# EAGLE schematic led-cpu-rev2 (EAGLE 6.4)
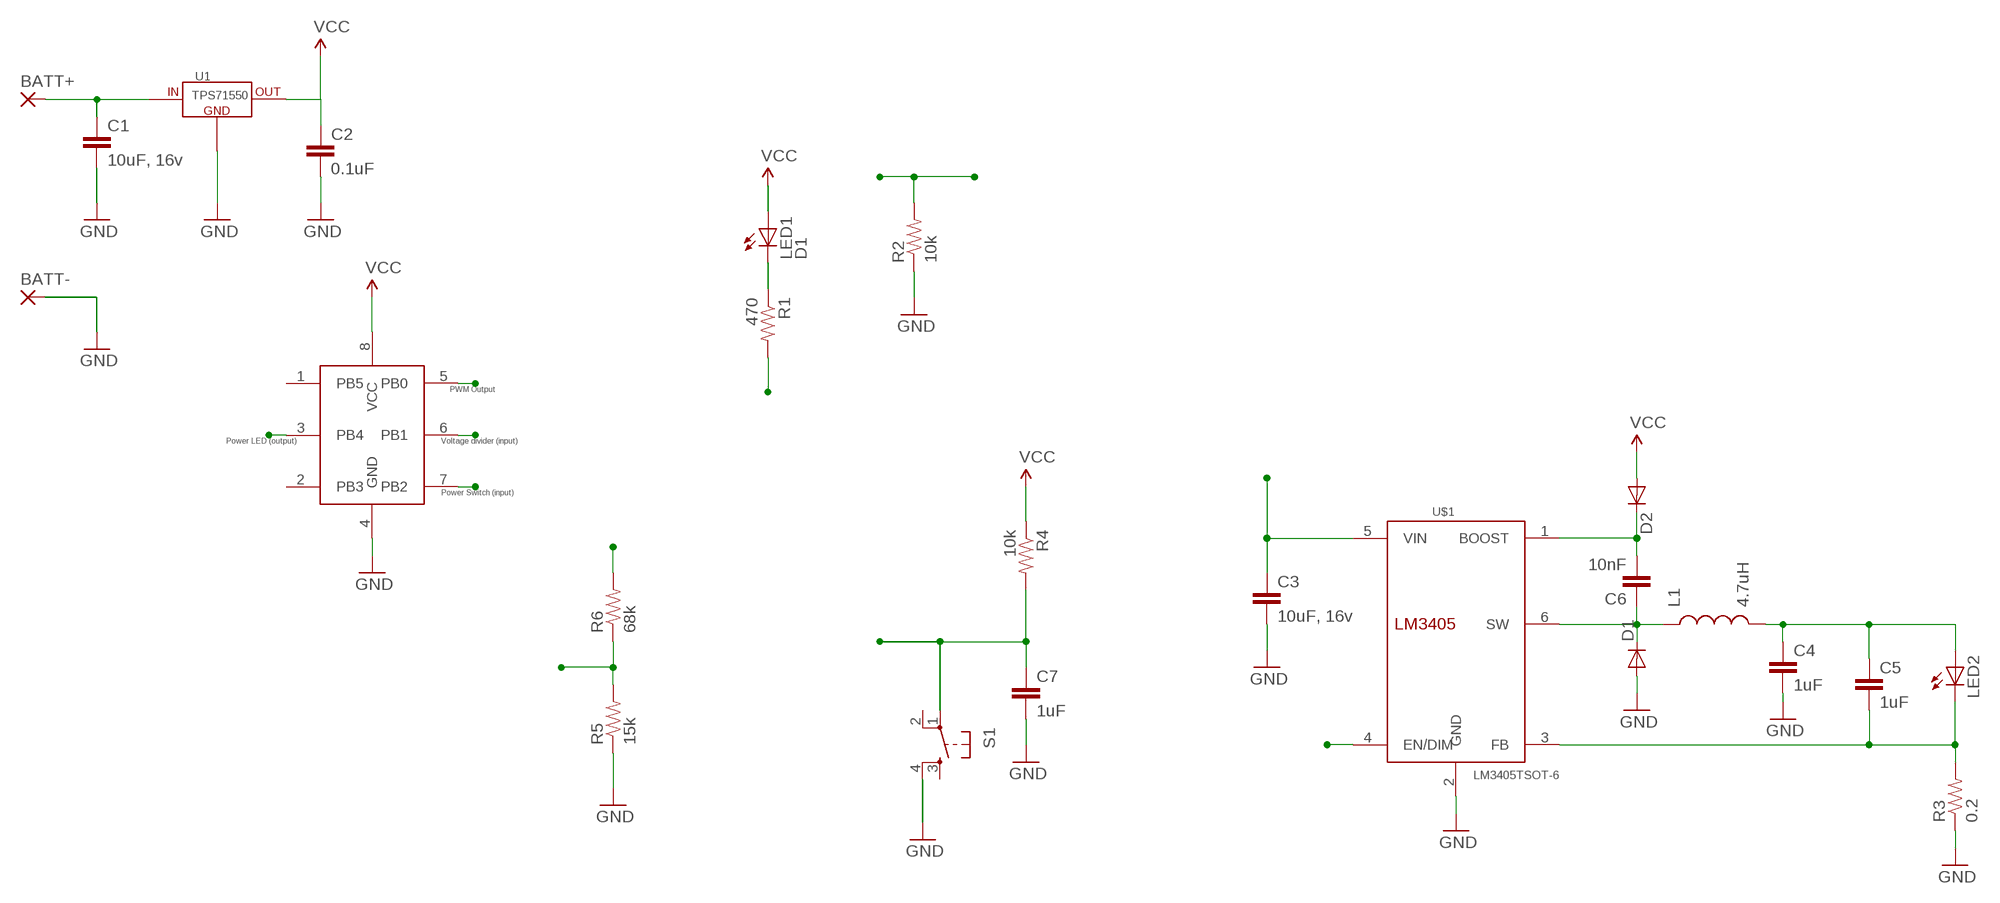
[diagram p0: schematic, sheet 1]

## Parts
BATT+  SMD5  [SMD2,54-5,08]
BATT-  SMD5  [SMD2,54-5,08]
C1  10uF, 16v  CAP0805  [0805]
C2  0.1uF  CAP0805  [0805]
C3  10uF, 16v  CAP0805  [0805]
C4  1uF  CAP1206  [1206]
C5  1uF  CAP1206  [1206]
C6  10nF  CAP0805  [0805]
C7  1uF  CAP0805  [0805]
D1  DIODESMA  [SMA-DIODE]
D2  DIODESOD  [SOD-323]
L1  4.7uH  INDUCTOR1210  [1210]
LED1  D1  LEDCHIPLED_0603  [CHIPLED_0603]
LED2  LED3MM  [LED3MM]
R1  470  RESISTOR0805-RES  [0805]
R2  10k  RESISTOR0805-RES  [0805]
R3  0.2  RESISTOR1206  [1206]
R4  10k  RESISTOR0805-RES  [0805]
R5  15k  RESISTOR0805-RES  [0805]
R6  68k  RESISTOR0805-RES  [0805]
S1  TAC_SWITCHPTH  [TACTILE-PTH]
U1  TPS71550  TPS715XX  [SOT-23-5]
U2  ATTINY13  [WSOIC-8]
U$1  LM3405TSOT-6  [TSOT-6]

## Nets
BATT+: BATT+.1(P) C1.1 C3.1 R6.2 U1.4(IN) U$1.5(VIN)
GND: BATT-.1(P) C1.2 C2.2 C3.2 C4.2 C7.2 D1.A R2.1 R3.1 R5.1 S1.4 U1.2(GND) U2.4(GND) U$1.2(GND)
IND_LED_B: R1.2 U2.3(PB4)
N$1: LED1.C R1.1
N$2: C5.2 LED2.K(C) R3.2 U$1.3(FB)
N$3: C6.1 D1.C L1.1 U$1.6(SW)
N$4: C6.2 D2.1(C) U$1.1(BOOST)
N$5: C4.1 C5.1 L1.2 LED2.A
PWM_OUT: R2.2 U2.5(PB0) U$1.4(EN/DIM)
PWR_SW: C7.1 R4.2 S1.1 U2.7(PB2)
VCC: C2.1 D2.2(A) LED1.A R4.1 U1.5(OUT) U2.8(VCC)
VDIV: R5.2 R6.1 U2.6(PB1)
Unconnected: S1.2 S1.3 U2.1(PB5) U2.2(PB3)

## Notes on the sheet
- PWM Output
- Power LED (output) | Voltage divider (input)
- Power Switch (input)

## Library data of the parts
BATT+ BATT- = wirepad:SMD5: SMD PAD
C1-C7 = SparkFun-Capacitors:CAP: Capacitor Standard 0603 ceramic capacitor, and 0.1" leaded capacitor.
D1 D2 = SparkFun-DiscreteSemi:DIODE: Diode These are standard reverse protection diodes and small signal diodes. SMA package can handle up to about 1A. SOD-323 can handle about 200mA. What the SOD-323 package when ordering, there are some mfgs out there that are 5-pin packages.
L1 = SparkFun-Passives:INDUCTOR: Inductors Basic Inductor/Choke - 0603 and 1206. Footprints are not proven and vary greatly between part numbers.
LED1 = led:LED: LED OSRAM: - CHIPLED LG R971, LG N971, LY N971, LG Q971, LY Q971, LO R971, LY R971 LH N974, LH R974 LS Q976, LO Q976, LY Q976 LO Q996 - Hyper CHIPLED LW Q18S LB Q993, LB Q99A, LB R99A - SideLED LS A670, LO A670, LY A670, LG A670, LP A670 LB A673, LV A673, LT A673, LW A673 LH A674 LY A675 LS A676, LA A676, LO A676, LY A676, LW A676 LS A679, LY A679, LG A679 - Hyper Micro SIDELED® LS Y876, LA Y876, LO Y876, LY Y876 LT Y87S - SmartLED LW L88C, LW L88S LB L89C, LB L89S, LG L890 LS L89K, LO L89K, LY L89K LS L896, LA L896, LO L896, LY L896 - TOPLED LS T670, LO T670, LY T670, LG T670, LP T670 LSG T670, LSP T670, LSY T670, LOP T670, LYG T670 LG T671, LOG T671, LSG T671 LB T673, LV T673, LT T673, LW T673 LH T674 LS T676, LA T676, LO T676, LY T676, LB T676, LH T676, LSB T676, LW T676 LB T67C, LV T67C, LT T67C, LS T67K, LO T67K, LY T67K, LW E67C LS E67B, LA E67B, LO E67B, LY E67B, LB E67C, LV E67C, LT E67C LW T67C LS T679, LY T679, LG T679 LS T770, LO T770, LY T770, LG T770, LP T770 LB T773, LV T773, LT T773, LW T773 LH T774 LS E675, LA E675, LY E675, LS T675 LS T776, LA T776, LO T776, LY T776, LB T776 LHGB T686 LT T68C, LB T68C - Hyper Mini TOPLED® LB M676 - Mini TOPLED Santana® LG M470 LS M47K, LO M47K, LY M47K Source: http://www.osram.convergy.de LUXEON: - LUMILED® LXK2-PW12-R00, LXK2-PW12-S00, LXK2-PW14-U00, LXK2-PW14-V00 LXK2-PM12-R00, LXK2-PM12-S00, LXK2-PM14-U00 LXK2-PE12-Q00, LXK2-PE12-R00, LXK2-PE12-S00, LXK2-PE14-T00, LXK2-PE14-U00 LXK2-PB12-K00, LXK2-PB12-L00, LXK2-PB12-M00, LXK2-PB14-N00, LXK2-PB14-P00, LXK2-PB14-Q00 LXK2-PR12-L00, LXK2-PR12-M00, LXK2-PR14-Q00, LXK2-PR14-R00 LXK2-PD12-Q00, LXK2-PD12-R00, LXK2-PD12-S00 LXK2-PH12-R00, LXK2-PH12-S00 LXK2-PL12-P00, LXK2-PL12-Q00, LXK2-PL12-R00 Source: www.luxeon.com KINGBRIGHT: KA-3528ASYC Source: www.kingbright.com
LED2 = SparkFun-LED:LED: LEDs Standard schematic elements and footprints for 5mm, 3mm, 1206, and 0603 sized LEDs. 5mm - Spark Fun Electronics SKU : COM-00529 (and others)
R1 R2 R4-R6 = SparkFun:RESISTOR: Resistor Basic schematic elements and footprints for 0603, 1206, and PTH resistors.
R3 = SparkFun-Resistors:RESISTOR: Resistor Basic schematic elements and footprints for 0603, 1206, and PTH resistors.
S1 = SparkFun:TAC_SWITCH: Momentary Switch Button commonly used for reset or general input. Spark Fun Electronics SKU : COM-00097
U1 = Synapseware:TPS715XX: 50 mA, 24 V, 3.2-mA Supply Current Low-Dropout Linear Regulator in SC70 (SOT-323) Package TPS71550DCKR - 5.0V version TPS71533DCKR - 3.3V version TPS71525DCKR - 2.5V version
U2 = Synapseware:ATTINY13: The ATtiny13 is a low-power CMOS 8-bit microcontroller based on the AVR enhanced RISC architecture. By executing powerful instructions in a single clock cycle, the ATtiny13 achieves throughputs approaching 1 MIPS per MHz allowing the system designer to optimize power consumption versus processing speed.
U$1 = Synapseware:LM3405: LM3405 1.6MHz, 1A Constant Current Buck Regulator for Powering LEDs